# Altium schematic sheet PG03_ Qseven Connector.SchDoc
size 420 x 297 mm
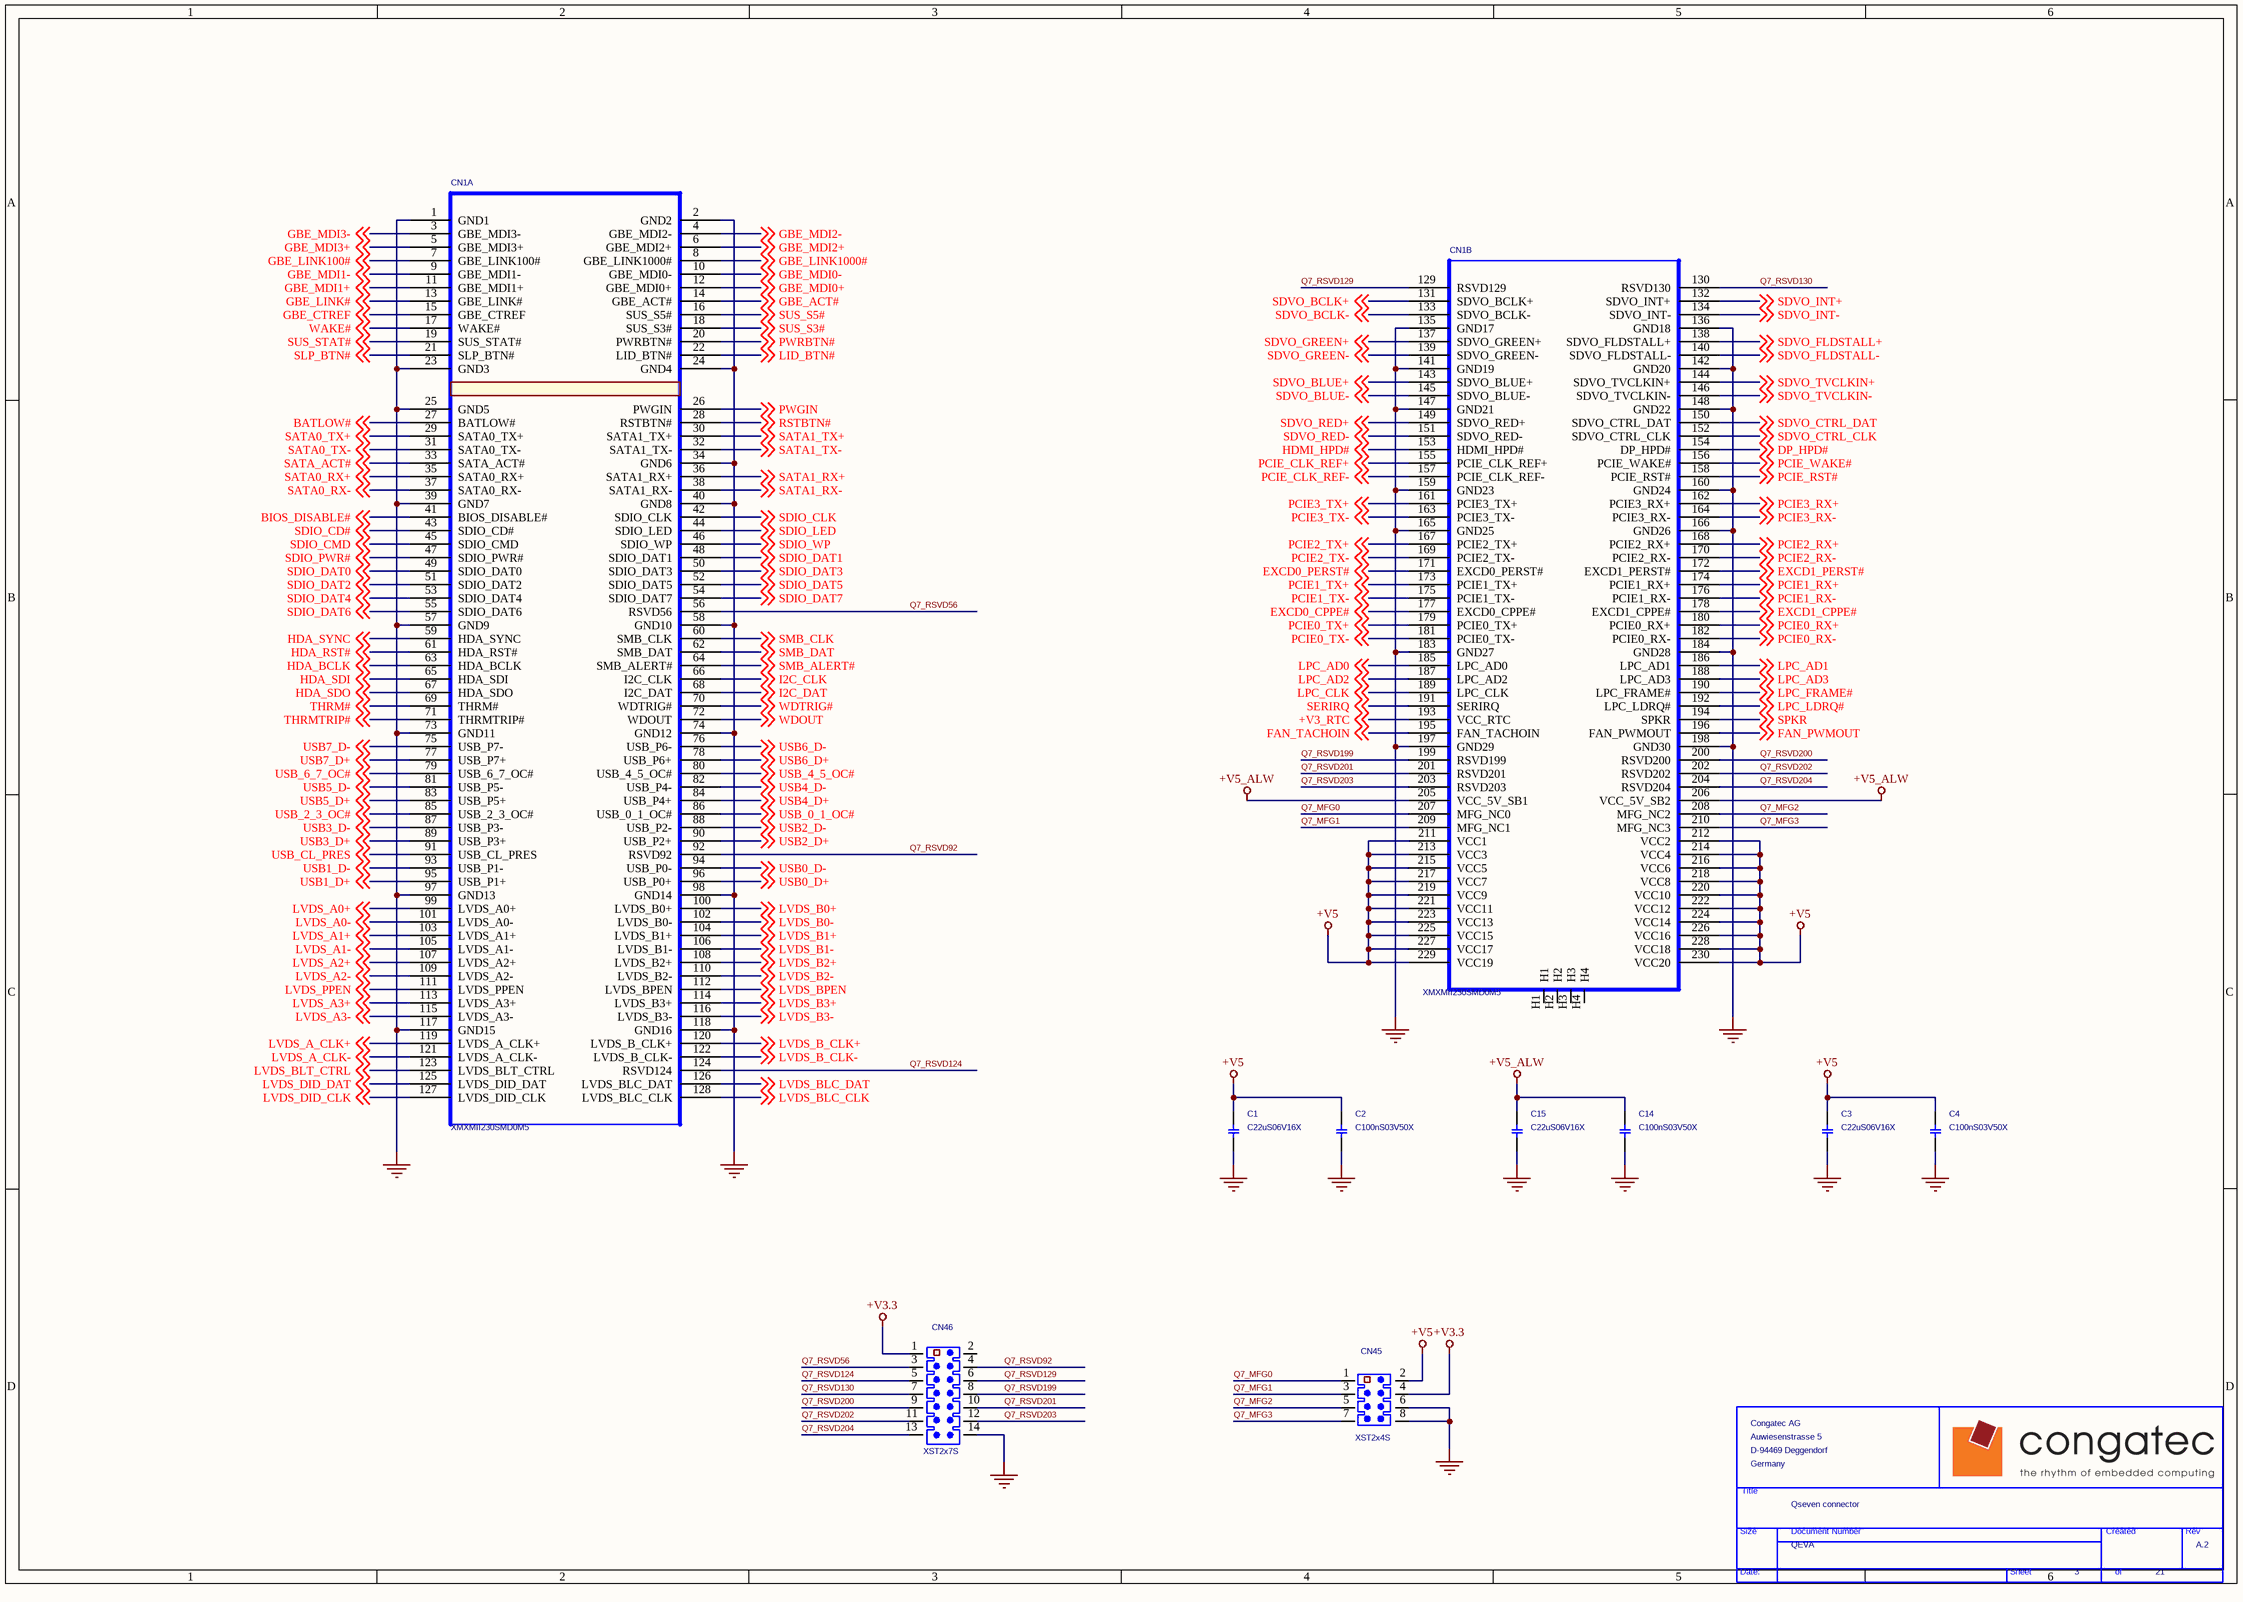
[diagram p0: PG03_ Qseven Connector.SchDoc]

## Parts
*  Page Count: 21  Page Number: 3  Title: Qseven connector  RevCode: A.2  Doc: QEVA  OrgName: Congatec AG  OrgAddr1: Auwiesenstrasse 5  OrgAddr2: D-94469 Deggendorf  OrgAddr3: Germany  (hidden comment: TitleBlock_CONGA)  (graphical)
C1  C22uS06V16X  [C1206-1]
C2  C100nS03V50X  [C0603]
C3  C22uS06V16X  [C1206-1]
C4  C100nS03V50X  [C0603]
C14  C100nS03V50X  [C0603]
C15  C22uS06V16X  [C1206-1]
CN1  XMXMII230SMD0M5  [FOXCONN_AS0B326-S78N-7F]  (parts A,B of 2)
CN45  XST2x4S  [JH4X2V]
CN46  XST2x7S  [JH7X2V]

## Nets
+V3.3: CN45.4 CN46.1
+V5: C1.1 C2.1 C3.1 C4.1 CN1.211(VCC1) CN1.212(VCC2) CN1.213(VCC3) CN1.214(VCC4) CN1.215(VCC5) CN1.216(VCC6) CN1.217(VCC7) CN1.218(VCC8) CN1.219(VCC9) CN1.220(VCC10) CN1.221(VCC11) CN1.222(VCC12) CN1.223(VCC13) CN1.224(VCC14) CN1.225(VCC15) CN1.226(VCC16) CN1.227(VCC17) CN1.228(VCC18) CN1.229(VCC19) CN1.230(VCC20) CN45.2
+V5_ALW: C14.1 C15.1 CN1.205(VCC_5V_SB1) CN1.206(VCC_5V_SB2)
GND: C1.2 C2.2 C3.2 C4.2 C14.2 C15.2 CN1.1(GND1) CN1.2(GND2) CN1.23(GND3) CN1.24(GND4) CN1.25(GND5) CN1.34(GND6) CN1.39(GND7) CN1.40(GND8) CN1.57(GND9) CN1.58(GND10) CN1.73(GND11) CN1.74(GND12) CN1.97(GND13) CN1.98(GND14) CN1.117(GND15) CN1.118(GND16) CN1.135(GND17) CN1.136(GND18) CN1.141(GND19) CN1.142(GND20) CN1.147(GND21) CN1.148(GND22) CN1.159(GND23) CN1.160(GND24) CN1.165(GND25) CN1.166(GND26) CN1.183(GND27) CN1.184(GND28) CN1.197(GND29) CN1.198(GND30) CN45.6 CN45.8 CN46.14
+V3_RTC: CN1.193(VCC_RTC) ; off-sheet +V3_RTC
BATLOW#: CN1.27(BATLOW#) ; off-sheet BATLOW#
BIOS_DISABLE#: CN1.41(BIOS_DISABLE#) ; off-sheet BIOS_DISABLE#
DP_HPD#: CN1.154(DP_HPD#) ; off-sheet DP_HPD#
EXCD0_CPPE#: CN1.177(EXCD0_CPPE#) ; off-sheet EXCD0_CPPE#
EXCD0_PERST#: CN1.171(EXCD0_PERST#) ; off-sheet EXCD0_PERST#
EXCD1_CPPE#: CN1.178(EXCD1_CPPE#) ; off-sheet EXCD1_CPPE#
EXCD1_PERST#: CN1.172(EXCD1_PERST#) ; off-sheet EXCD1_PERST#
FAN_PWMOUT: CN1.196(FAN_PWMOUT) ; off-sheet FAN_PWMOUT
FAN_TACHOIN: CN1.195(FAN_TACHOIN) ; off-sheet FAN_TACHOIN
GBE_ACT#: CN1.14(GBE_ACT#) ; off-sheet GBE_ACT#
GBE_CTREF: CN1.15(GBE_CTREF) ; off-sheet GBE_CTREF
GBE_LINK100#: CN1.7(GBE_LINK100#) ; off-sheet GBE_LINK100#
GBE_LINK1000#: CN1.8(GBE_LINK1000#) ; off-sheet GBE_LINK1000#
GBE_LINK#: CN1.13(GBE_LINK#) ; off-sheet GBE_LINK#
GBE_MDI0+: CN1.12(GBE_MDI0+) ; off-sheet GBE_MDI0+
GBE_MDI0-: CN1.10(GBE_MDI0-) ; off-sheet GBE_MDI0-
GBE_MDI1+: CN1.11(GBE_MDI1+) ; off-sheet GBE_MDI1+
GBE_MDI1-: CN1.9(GBE_MDI1-) ; off-sheet GBE_MDI1-
GBE_MDI2+: CN1.6(GBE_MDI2+) ; off-sheet GBE_MDI2+
GBE_MDI2-: CN1.4(GBE_MDI2-) ; off-sheet GBE_MDI2-
GBE_MDI3+: CN1.5(GBE_MDI3+) ; off-sheet GBE_MDI3+
GBE_MDI3-: CN1.3(GBE_MDI3-) ; off-sheet GBE_MDI3-
HDA_BCLK: CN1.63(HDA_BCLK) ; off-sheet HDA_BCLK
HDA_RST#: CN1.61(HDA_RST#) ; off-sheet HDA_RST#
HDA_SDI: CN1.65(HDA_SDI) ; off-sheet HDA_SDI
HDA_SDO: CN1.67(HDA_SDO) ; off-sheet HDA_SDO
HDA_SYNC: CN1.59(HDA_SYNC) ; off-sheet HDA_SYNC
HDMI_HPD#: CN1.153(HDMI_HPD#) ; off-sheet HDMI_HPD#
I2C_CLK: CN1.66(I2C_CLK) ; off-sheet I2C_CLK
I2C_DAT: CN1.68(I2C_DAT) ; off-sheet I2C_DAT
LID_BTN#: CN1.22(LID_BTN#) ; off-sheet LID_BTN#
LPC_AD0: CN1.185(LPC_AD0) ; off-sheet LPC_AD0
LPC_AD1: CN1.186(LPC_AD1) ; off-sheet LPC_AD1
LPC_AD2: CN1.187(LPC_AD2) ; off-sheet LPC_AD2
LPC_AD3: CN1.188(LPC_AD3) ; off-sheet LPC_AD3
LPC_CLK: CN1.189(LPC_CLK) ; off-sheet LPC_CLK
LPC_FRAME#: CN1.190(LPC_FRAME#) ; off-sheet LPC_FRAME#
LPC_LDRQ#: CN1.192(LPC_LDRQ#) ; off-sheet LPC_LDRQ#
LVDS_A0+: CN1.99(LVDS_A0+) ; off-sheet LVDS_A0+
LVDS_A0-: CN1.101(LVDS_A0-) ; off-sheet LVDS_A0-
LVDS_A1+: CN1.103(LVDS_A1+) ; off-sheet LVDS_A1+
LVDS_A1-: CN1.105(LVDS_A1-) ; off-sheet LVDS_A1-
LVDS_A2+: CN1.107(LVDS_A2+) ; off-sheet LVDS_A2+
LVDS_A2-: CN1.109(LVDS_A2-) ; off-sheet LVDS_A2-
LVDS_A3+: CN1.113(LVDS_A3+) ; off-sheet LVDS_A3+
LVDS_A3-: CN1.115(LVDS_A3-) ; off-sheet LVDS_A3-
LVDS_A_CLK+: CN1.119(LVDS_A_CLK+) ; off-sheet LVDS_A_CLK+
LVDS_A_CLK-: CN1.121(LVDS_A_CLK-) ; off-sheet LVDS_A_CLK-
LVDS_B0+: CN1.100(LVDS_B0+) ; off-sheet LVDS_B0+
LVDS_B0-: CN1.102(LVDS_B0-) ; off-sheet LVDS_B0-
LVDS_B1+: CN1.104(LVDS_B1+) ; off-sheet LVDS_B1+
LVDS_B1-: CN1.106(LVDS_B1-) ; off-sheet LVDS_B1-
LVDS_B2+: CN1.108(LVDS_B2+) ; off-sheet LVDS_B2+
LVDS_B2-: CN1.110(LVDS_B2-) ; off-sheet LVDS_B2-
LVDS_B3+: CN1.114(LVDS_B3+) ; off-sheet LVDS_B3+
LVDS_B3-: CN1.116(LVDS_B3-) ; off-sheet LVDS_B3-
LVDS_B_CLK+: CN1.120(LVDS_B_CLK+) ; off-sheet LVDS_B_CLK+
LVDS_B_CLK-: CN1.122(LVDS_B_CLK-) ; off-sheet LVDS_B_CLK-
LVDS_BLC_CLK: CN1.128(LVDS_BLC_CLK) ; off-sheet LVDS_BLC_CLK
LVDS_BLC_DAT: CN1.126(LVDS_BLC_DAT) ; off-sheet LVDS_BLC_DAT
LVDS_BLT_CTRL: CN1.123(LVDS_BLT_CTRL) ; off-sheet LVDS_BLT_CTRL
LVDS_BPEN: CN1.112(LVDS_BPEN) ; off-sheet LVDS_BPEN
LVDS_DID_CLK: CN1.127(LVDS_DID_CLK) ; off-sheet LVDS_DID_CLK
LVDS_DID_DAT: CN1.125(LVDS_DID_DAT) ; off-sheet LVDS_DID_DAT
LVDS_PPEN: CN1.111(LVDS_PPEN) ; off-sheet LVDS_PPEN
PCIE0_RX+: CN1.180(PCIE0_RX+) ; off-sheet PCIE0_RX+
PCIE0_RX-: CN1.182(PCIE0_RX-) ; off-sheet PCIE0_RX-
PCIE0_TX+: CN1.179(PCIE0_TX+) ; off-sheet PCIE0_TX+
PCIE0_TX-: CN1.181(PCIE0_TX-) ; off-sheet PCIE0_TX-
PCIE1_RX+: CN1.174(PCIE1_RX+) ; off-sheet PCIE1_RX+
PCIE1_RX-: CN1.176(PCIE1_RX-) ; off-sheet PCIE1_RX-
PCIE1_TX+: CN1.173(PCIE1_TX+) ; off-sheet PCIE1_TX+
PCIE1_TX-: CN1.175(PCIE1_TX-) ; off-sheet PCIE1_TX-
PCIE2_RX+: CN1.168(PCIE2_RX+) ; off-sheet PCIE2_RX+
PCIE2_RX-: CN1.170(PCIE2_RX-) ; off-sheet PCIE2_RX-
PCIE2_TX+: CN1.167(PCIE2_TX+) ; off-sheet PCIE2_TX+
PCIE2_TX-: CN1.169(PCIE2_TX-) ; off-sheet PCIE2_TX-
PCIE3_RX+: CN1.162(PCIE3_RX+) ; off-sheet PCIE3_RX+
PCIE3_RX-: CN1.164(PCIE3_RX-) ; off-sheet PCIE3_RX-
PCIE3_TX+: CN1.161(PCIE3_TX+) ; off-sheet PCIE3_TX+
PCIE3_TX-: CN1.163(PCIE3_TX-) ; off-sheet PCIE3_TX-
PCIE_CLK_REF+: CN1.155(PCIE_CLK_REF+) ; off-sheet PCIE_CLK_REF+
PCIE_CLK_REF-: CN1.157(PCIE_CLK_REF-) ; off-sheet PCIE_CLK_REF-
PCIE_RST#: CN1.158(PCIE_RST#) ; off-sheet PCIE_RST#
PCIE_WAKE#: CN1.156(PCIE_WAKE#) ; off-sheet PCIE_WAKE#
PWGIN: CN1.26(PWGIN) ; off-sheet PWGIN
PWRBTN#: CN1.20(PWRBTN#) ; off-sheet PWRBTN#
Q7_MFG0: CN1.207(MFG_NC0) CN45.1
Q7_MFG1: CN1.209(MFG_NC1) CN45.3
Q7_MFG2: CN1.208(MFG_NC2) CN45.5
Q7_MFG3: CN1.210(MFG_NC3) CN45.7
Q7_RSVD56: CN1.56(RSVD56) CN46.3
Q7_RSVD92: CN1.92(RSVD92) CN46.4
Q7_RSVD124: CN1.124(RSVD124) CN46.5
Q7_RSVD129: CN1.129(RSVD129) CN46.6
Q7_RSVD130: CN1.130(RSVD130) CN46.7
Q7_RSVD199: CN1.199(RSVD199) CN46.8
Q7_RSVD200: CN1.200(RSVD200) CN46.9
Q7_RSVD201: CN1.201(RSVD201) CN46.10
Q7_RSVD202: CN1.202(RSVD202) CN46.11
Q7_RSVD203: CN1.203(RSVD203) CN46.12
Q7_RSVD204: CN1.204(RSVD204) CN46.13
RSTBTN#: CN1.28(RSTBTN#) ; off-sheet RSTBTN#
SATA0_RX+: CN1.35(SATA0_RX+) ; off-sheet SATA0_RX+
SATA0_RX-: CN1.37(SATA0_RX-) ; off-sheet SATA0_RX-
SATA0_TX+: CN1.29(SATA0_TX+) ; off-sheet SATA0_TX+
SATA0_TX-: CN1.31(SATA0_TX-) ; off-sheet SATA0_TX-
SATA1_RX+: CN1.36(SATA1_RX+) ; off-sheet SATA1_RX+
SATA1_RX-: CN1.38(SATA1_RX-) ; off-sheet SATA1_RX-
SATA1_TX+: CN1.30(SATA1_TX+) ; off-sheet SATA1_TX+
SATA1_TX-: CN1.32(SATA1_TX-) ; off-sheet SATA1_TX-
SATA_ACT#: CN1.33(SATA_ACT#) ; off-sheet SATA_ACT#
SDIO_CD#: CN1.43(SDIO_CD#) ; off-sheet SDIO_CD#
SDIO_CLK: CN1.42(SDIO_CLK) ; off-sheet SDIO_CLK
SDIO_CMD: CN1.45(SDIO_CMD) ; off-sheet SDIO_CMD
SDIO_DAT0: CN1.49(SDIO_DAT0) ; off-sheet SDIO_DAT0
SDIO_DAT1: CN1.48(SDIO_DAT1) ; off-sheet SDIO_DAT1
SDIO_DAT2: CN1.51(SDIO_DAT2) ; off-sheet SDIO_DAT2
SDIO_DAT3: CN1.50(SDIO_DAT3) ; off-sheet SDIO_DAT3
SDIO_DAT4: CN1.53(SDIO_DAT4) ; off-sheet SDIO_DAT4
SDIO_DAT5: CN1.52(SDIO_DAT5) ; off-sheet SDIO_DAT5
SDIO_DAT6: CN1.55(SDIO_DAT6) ; off-sheet SDIO_DAT6
SDIO_DAT7: CN1.54(SDIO_DAT7) ; off-sheet SDIO_DAT7
SDIO_LED: CN1.44(SDIO_LED) ; off-sheet SDIO_LED
SDIO_PWR#: CN1.47(SDIO_PWR#) ; off-sheet SDIO_PWR#
SDIO_WP: CN1.46(SDIO_WP) ; off-sheet SDIO_WP
SDVO_BCLK+: CN1.131(SDVO_BCLK+) ; off-sheet SDVO_BCLK+
SDVO_BCLK-: CN1.133(SDVO_BCLK-) ; off-sheet SDVO_BCLK-
SDVO_BLUE+: CN1.143(SDVO_BLUE+) ; off-sheet SDVO_BLUE+
SDVO_BLUE-: CN1.145(SDVO_BLUE-) ; off-sheet SDVO_BLUE-
SDVO_CTRL_CLK: CN1.152(SDVO_CTRL_CLK) ; off-sheet SDVO_CTRL_CLK
SDVO_CTRL_DAT: CN1.150(SDVO_CTRL_DAT) ; off-sheet SDVO_CTRL_DAT
SDVO_FLDSTALL+: CN1.138(SDVO_FLDSTALL+) ; off-sheet SDVO_FLDSTALL+
SDVO_FLDSTALL-: CN1.140(SDVO_FLDSTALL-) ; off-sheet SDVO_FLDSTALL-
SDVO_GREEN+: CN1.137(SDVO_GREEN+) ; off-sheet SDVO_GREEN+
SDVO_GREEN-: CN1.139(SDVO_GREEN-) ; off-sheet SDVO_GREEN-
SDVO_INT+: CN1.132(SDVO_INT+) ; off-sheet SDVO_INT+
SDVO_INT-: CN1.134(SDVO_INT-) ; off-sheet SDVO_INT-
SDVO_RED+: CN1.149(SDVO_RED+) ; off-sheet SDVO_RED+
SDVO_RED-: CN1.151(SDVO_RED-) ; off-sheet SDVO_RED-
SDVO_TVCLKIN+: CN1.144(SDVO_TVCLKIN+) ; off-sheet SDVO_TVCLKIN+
SDVO_TVCLKIN-: CN1.146(SDVO_TVCLKIN-) ; off-sheet SDVO_TVCLKIN-
SERIRQ: CN1.191(SERIRQ) ; off-sheet SERIRQ
SLP_BTN#: CN1.21(SLP_BTN#) ; off-sheet SLP_BTN#
SMB_ALERT#: CN1.64(SMB_ALERT#) ; off-sheet SMB_ALERT#
SMB_CLK: CN1.60(SMB_CLK) ; off-sheet SMB_CLK
SMB_DAT: CN1.62(SMB_DAT) ; off-sheet SMB_DAT
SPKR: CN1.194(SPKR) ; off-sheet SPKR
SUS_S3#: CN1.18(SUS_S3#) ; off-sheet SUS_S3#
SUS_S5#: CN1.16(SUS_S5#) ; off-sheet SUS_S5#
SUS_STAT#: CN1.19(SUS_STAT#) ; off-sheet SUS_STAT#
THRM#: CN1.69(THRM#) ; off-sheet THRM#
THRMTRIP#: CN1.71(THRMTRIP#) ; off-sheet THRMTRIP#
USB0_D+: CN1.96(USB_P0+) ; off-sheet USB0_D+
USB0_D-: CN1.94(USB_P0-) ; off-sheet USB0_D-
USB1_D+: CN1.95(USB_P1+) ; off-sheet USB1_D+
USB1_D-: CN1.93(USB_P1-) ; off-sheet USB1_D-
USB2_D+: CN1.90(USB_P2+) ; off-sheet USB2_D+
USB2_D-: CN1.88(USB_P2-) ; off-sheet USB2_D-
USB3_D+: CN1.89(USB_P3+) ; off-sheet USB3_D+
USB3_D-: CN1.87(USB_P3-) ; off-sheet USB3_D-
USB4_D+: CN1.84(USB_P4+) ; off-sheet USB4_D+
USB4_D-: CN1.82(USB_P4-) ; off-sheet USB4_D-
USB5_D+: CN1.83(USB_P5+) ; off-sheet USB5_D+
USB5_D-: CN1.81(USB_P5-) ; off-sheet USB5_D-
USB6_D+: CN1.78(USB_P6+) ; off-sheet USB6_D+
USB6_D-: CN1.76(USB_P6-) ; off-sheet USB6_D-
USB7_D+: CN1.77(USB_P7+) ; off-sheet USB7_D+
USB7_D-: CN1.75(USB_P7-) ; off-sheet USB7_D-
USB_0_1_OC#: CN1.86(USB_0_1_OC#) ; off-sheet USB_0_1_OC#
USB_2_3_OC#: CN1.85(USB_2_3_OC#) ; off-sheet USB_2_3_OC#
USB_4_5_OC#: CN1.80(USB_4_5_OC#) ; off-sheet USB_4_5_OC#
USB_6_7_OC#: CN1.79(USB_6_7_OC#) ; off-sheet USB_6_7_OC#
USB_CL_PRES: CN1.91(USB_CL_PRES) ; off-sheet USB_CL_PRES
WAKE#: CN1.17(WAKE#) ; off-sheet WAKE#
WDOUT: CN1.72(WDOUT) ; off-sheet WDOUT
WDTRIG#: CN1.70(WDTRIG#) ; off-sheet WDTRIG#

Not connected (* = marked no-connect by the designer): CN1 H1 H2 H3 H4; CN46 2

## Notes on the sheet
- (in symbol TitleBlock_CONGA) Title; Size; Document Number; Created; Rev; Date:; Sheet; of

## Library data of the parts
C1 C3 C15 = 11_C_0: CAP 22uF 16V X5R SMD 1206 MLCC WO/PB; Part Number: 1100001310; Manufacture Part Number: KC30R1C226M-T; Part_Number: 41000341; Tolerance: 20%; ProcessType: SMT; BOM_Level: 1; Package: 1206; Revision: A
C2 C4 C14 = 11_C_0: CAP 0.1U 50V +-10% SMD 0603 X7R WO/Pb; Part_Number: 41000289; Manufacture Part Number: C1608X7R1H104KT試223858615649; Part Number: 1100000214; BOM_Level: 1; ProcessType: SMT; Tolerance: 10%; Revision: A; Package: 0603
CN1 = Qseven: Part Number: 1654005496; Part_Number: 41500262; BOM_Level: 1; Revision: A
CN45 = 1653_JH4X2V_0: PIN HEADER 4*2P 180D(M) 2.54mm DIP WO/Pb; Part_Number: 41500115; Manufacture Part Number: 201-2*4GS試21N22564-08S10B-01G-6/3; Part Number: 1653004200; BOM_Level: 1; Revision: A; ProcessType: DIP; Package: PH4x2P-2.54
CN46 = 1653_JH7X2V_0: PIN HEADER 7*2P 180D(M) 2.54mm DIP WO/Pb; Manufacture Part Number: $1653007200試1130-010-14S試21N22564-14S10B-01G-6/3; Part Number: 1653007200; Part_Number: 41500322; BOM_Level: 1; ProcessType: DIP; Package: PH7x2P-2.54; Revision: A
* = TitleBlock_CONGA: Page Create Date: March  8, 1995